# Altium schematic sheet main_arm.SchDoc
size A4
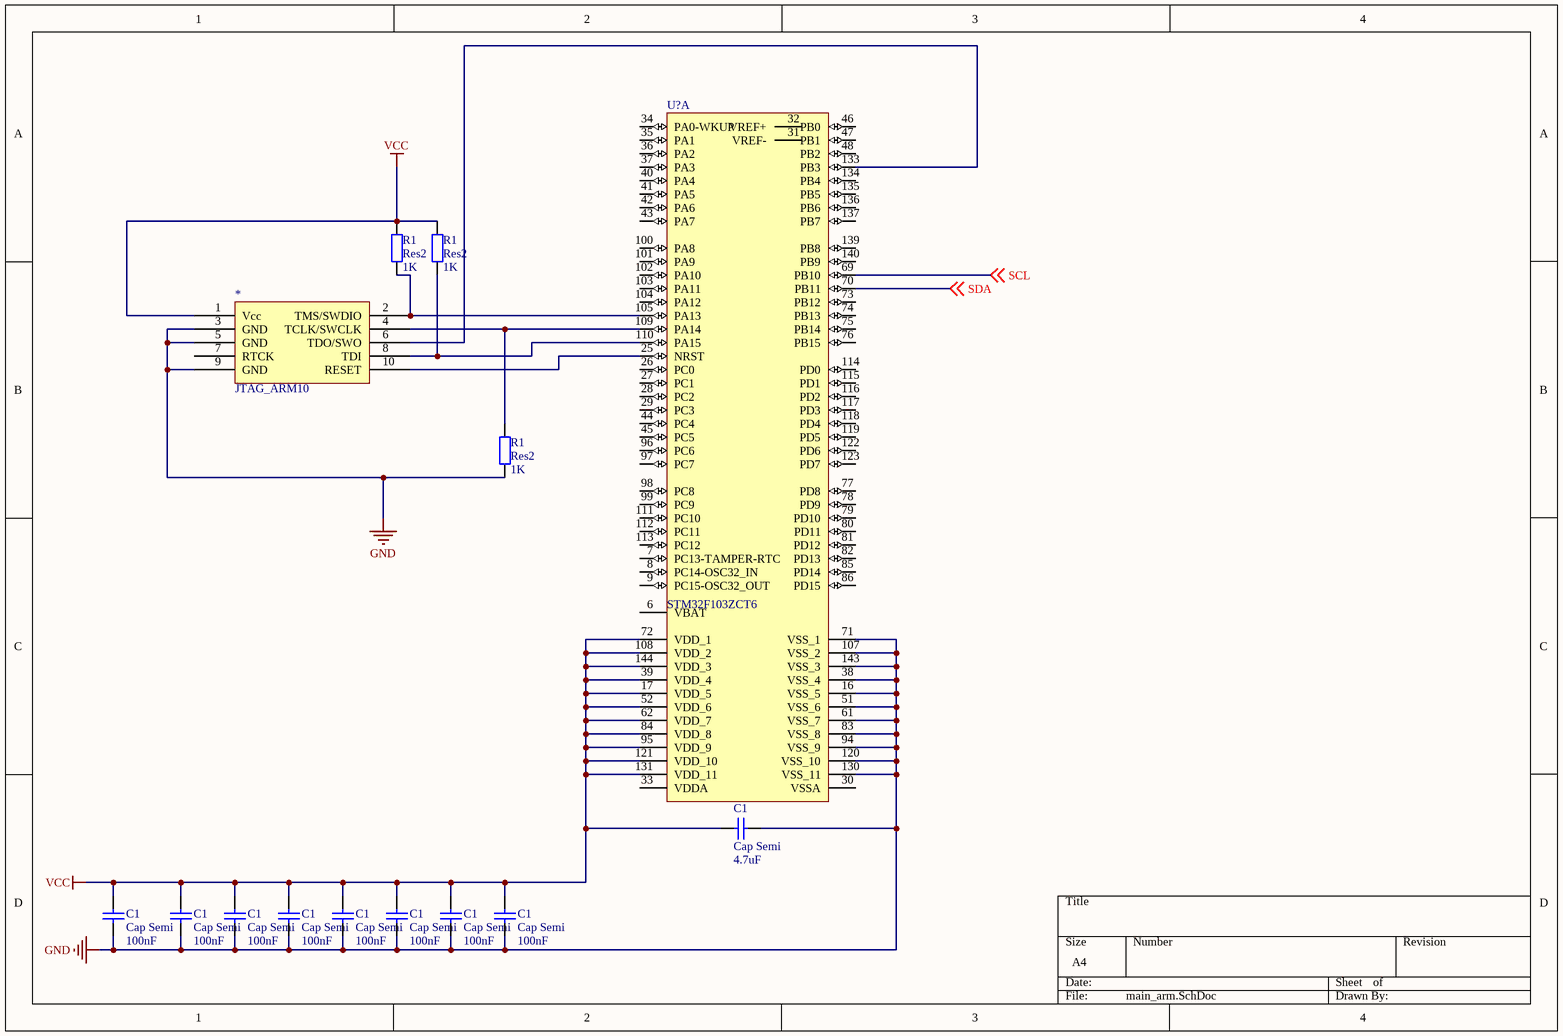
[diagram p0: main_arm.SchDoc]

## Parts
(Parts that share a designator on the sheet are numbered #1, #2 ... from top to bottom, then left to right.)
*  JTAG_ARM10
C1#1  Cap Semi  value 4.7uF  [C1206]
C1#2  Cap Semi  value 100nF  [C1206]
C1#3  Cap Semi  value 100nF  [C1206]
C1#4  Cap Semi  value 100nF  [C1206]
C1#5  Cap Semi  value 100nF  [C1206]
C1#6  Cap Semi  value 100nF  [C1206]
C1#7  Cap Semi  value 100nF  [C1206]
C1#8  Cap Semi  value 100nF  [C1206]
C1#9  Cap Semi  value 100nF  [C1206]
R1#1  Res2  value 1K  [AXIAL-0.4]
R1#2  Res2  value 1K  [AXIAL-0.4]
R1#3  Res2  value 1K  [AXIAL-0.4]
U?  STM32F103ZCT6  [STM-LQFP144_M]  (part A of 3)

## Nets
GND: *.3(GND) *.5(GND) *.9(GND) C1#1.1 C1#2.1 C1#3.1 C1#4.1 C1#5.1 C1#6.1 C1#7.1 C1#8.1 C1#9.1 R1#3.1 U?.16(VSS_5) U?.38(VSS_4) U?.51(VSS_6) U?.61(VSS_7) U?.71(VSS_1) U?.83(VSS_8) U?.94(VSS_9) U?.107(VSS_2) U?.120(VSS_10) U?.130(VSS_11) U?.143(VSS_3)
VCC: *.1(Vcc) C1#1.2 C1#2.2 C1#3.2 C1#4.2 C1#5.2 C1#6.2 C1#7.2 C1#8.2 C1#9.2 R1#1.2 R1#2.2 U?.17(VDD_5) U?.39(VDD_4) U?.52(VDD_6) U?.62(VDD_7) U?.72(VDD_1) U?.84(VDD_8) U?.95(VDD_9) U?.108(VDD_2) U?.121(VDD_10) U?.131(VDD_11) U?.144(VDD_3)
SCL: U?.69(PB10) ; off-sheet SCL
SDA: U?.70(PB11) ; off-sheet SDA
Net*_2: *.2(TMS/SWDIO) R1#1.1 U?.105(PA13)
Net*_4: *.4(TCLK/SWCLK) R1#3.2 U?.109(PA14)
Net*_6: *.6(TDO/SWO) U?.133(PB3)
Net*_8: *.8(TDI) R1#2.1 U?.110(PA15)
Net*_10: *.10(RESET) U?.25(NRST)

Not connected (* = marked no-connect by the designer): * 7(RTCK); U? 6(VBAT) 7(PC13-TAMPER-RTC) 8(PC14-OSC32_IN) 9(PC15-OSC32_OUT) 26(PC0) 27(PC1) 28(PC2) 29(PC3) 30(VSSA) 31(VREF-) 32(VREF+) 33(VDDA) 34(PA0-WKUP) 35(PA1) 36(PA2) 37(PA3) 40(PA4) 41(PA5) 42(PA6) 43(PA7) 44(PC4) 45(PC5) 46(PB0) 47(PB1) 48(PB2) 73(PB12) 74(PB13) 75(PB14) 76(PB15) 77(PD8) 78(PD9) 79(PD10) 80(PD11) 81(PD12) 82(PD13) 85(PD14) 86(PD15) 96(PC6) 97(PC7) 98(PC8) 99(PC9) 100(PA8) 101(PA9) 102(PA10) 103(PA11) 104(PA12) 111(PC10) 112(PC11) 113(PC12) 114(PD0) 115(PD1) 116(PD2) 117(PD3) 118(PD4) 119(PD5) 122(PD6) 123(PD7) 134(PB4) 135(PB5) 136(PB6) 137(PB7) 139(PB8) 140(PB9)

## Library data of the parts
C1#1-C1#9 = Cap Semi: Capacitor (Semiconductor SIM Model); Published: 8-Jun-2000; LatestRevisionDate: 29-May-2009; LatestRevisionNote: IPC-7351 Footprint Added.; PackageReference: C1206; Publisher: Altium Limited; PackageDescription: Chip Capacitor
R1#1-R1#3 = Res2: Resistor; Published: 8-Jun-2000; LatestRevisionDate: 17-Jul-2002; LatestRevisionNote: Re-released for DXP Platform.; PackageReference: AXIAL-0.4; Publisher: Altium Limited; PackageDescription: Axial Device, Thru-Hole; 2 Leads; 0.4 in Pin Spacing
U? = STM32F103ZCT6: ARM Cortex-M3 32-bit MCU, 256 KB Flash, 48 KB Internal RAM, 112 I/Os, 144-pin LQFP, -40 to 85 degC, Tray; A/D Converter: 3x12-bit (21 Channel); D/A Converter: 2x12-bit (2 Channel); FLASH Size (Prog) (kB): 256; I/Os (High Current): 112; Internal RAM Size (kB): 48; Operating Frequency(F) (Processor speed) (MHz): 72; Supply Voltage(Vcc) min (V): 2; DatasheetVersion: Rev. 8; PackageVersion: Rev. 4, 06/2013; PackageReference: LQFP144; PackageDescription: 144-Pin Low Profile Quad Flat Package, 20 x 20 mm Body, 0.5 mm Pitch; Supplier 1: Digi-Key; Supplier Part Number 1: 497-11542-ND; Supplier 2: Farnell; Supplier Part Number 2: 1624142; Supplier 3: Newark; Supplier Part Number 3: 57P1265; Supplier 4: Mouser; Supplier Part Number 4: 511-STM32F103ZCT6; Core: ARM Cortex-M3; Packing: Tray; Mounting Technology: Surface Mount; PartNumber: STM32F103ZCT6; ComponentLink1Description: Manufacturer URL; ComponentLink1URL: http://www.st.com/web/en/home.html; ComponentLink2Description: Datasheet; ComponentLink2URL: http://www.st.com/st-web-ui/static/active/en/resource/technical/document/datasheet/CD00191185.pdf; ComponentLink3Description: Package Specification; ComponentLink3URL: http://www.st.com/st-web-ui/static/active/en/resource/technical/document/datasheet/DM00037051.pdf